# Altium schematic sheet MicroMultimeter_PWR_Sch.SchDoc: MicroMultimeter - PWR
size 127 x 101 mm; Author: Hom; CompanyName: KitSprout; DrawnBy: Hom; Engineer: Hom; Organization: KitSprout; Revision: A; SheetNumber: 1; SheetTotal: 1; License: CC BY-SA 4.0; Version: 1.0; LibVersion: 1.4; PageSetup: Record=PageOptions|CenterHorizontal=True|CenterVertical=True|PrintScale=1.00|XCorrection=1.00|YCorrection=1.00|PrintKind=0|BorderSize=5000000|LeftOffset=0|BottomOffset=0|Orientation=2|PaperLength=1000|PaperWidth=1000|Scale=100|PaperSource=7|PrintQuality=-3|MediaType=1|DitherType=10|PrintScaleMode=0|PaperKind=A4|PaperIndex=9
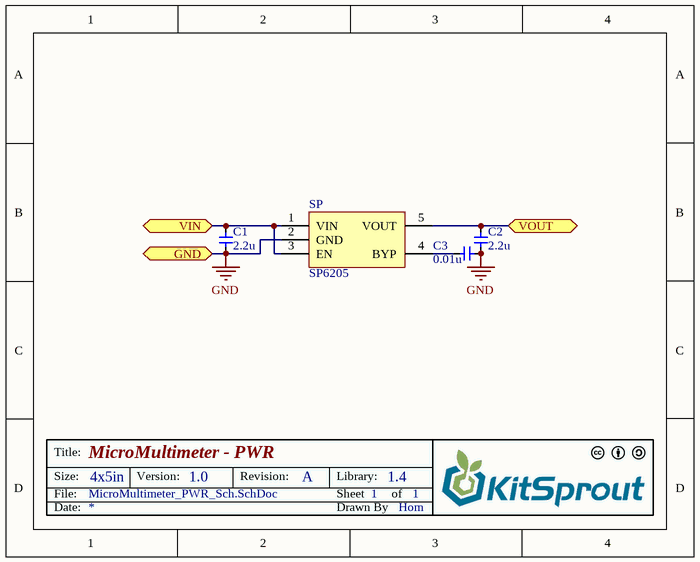
[diagram p0: MicroMultimeter_PWR_Sch.SchDoc]

## Parts
C1  value 2.2u  [CAP_0603]  (hidden comment: Cap_0603)
C2  value 2.2u  [CAP_0603]  (hidden comment: Cap_0603)
C3  value 0.01u  [CAP_0603]  (hidden comment: Cap_0603)
SP  SP6205  [SOT23-5]

## Ports
GND, VIN, VOUT

## Nets
GND: C1.1 C2.1 C3.1 SP.2(GND) ; port GND
VIN: C1.2 SP.1(VIN) SP.3(EN) ; port VIN
VOUT: C2.2 SP.5(VOUT) ; port VOUT
NetC3_2: C3.2 SP.4(BYP)

## Notes on the sheet
- Title:
- Size:
- Date:
- File:
- 4x5in
- Version:
- Revision:
- Sheet
- Drawn By
- Library:
- of

## Library data of the parts
C1-C3 = Cap_0603: Capacitor
SP = SP6205: Power